# Altium schematic sheet High_Current_LEDs.SchDoc
size A; SheetNumber: 6; SheetTotal: 7
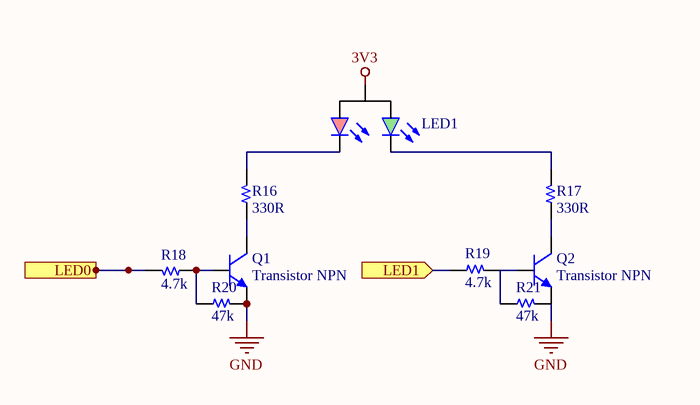
[diagram p0: High_Current_LEDs.SchDoc]

## Parts
LED1  Led 3pin 2color  [LED 3PIN 2COLOR 5MM]  (value not drawn)
Q1  Transistor NPN  [SOT-23]
Q2  Transistor NPN  [SOT-23]
R16  330R  [R 0805]
R17  330R  [R 0805]
R18  4.7k  [R 0805]
R19  4.7k  [R 0805]
R20  47k  [R 0805]
R21  47k  [R 0805]

## Ports
LED0 (in, see ESP32_WROM_32[2B]), LED1 (in, see ESP32_WROM_32[2B])

## Nets
3V3: LED1.2(A)
GND: Q1.2(E) Q2.2(E) R20.2 R21.2
LED0: R18.2 ; port LED0
LED1: R19.1 ; port LED1
NetLED1_1: LED1.1(RK) R16.2
NetLED1_3: LED1.3(YK) R17.2
NetQ1_1: Q1.1(B) R18.1 R20.1
NetQ1_3: Q1.3(C) R16.1
NetQ2_1: Q2.1(B) R19.2 R21.1
NetQ2_3: Q2.3(C) R17.1

## Library data of the parts
LED1 = Led 3pin 2color: Typical LED 3-pin 2-color
Q1 Q2 = Transistor NPN: NPN Bipolar Transistor
R16-R21 = Resistor